# Altium project RPI_FEZ_DAC_00.PrjPcb
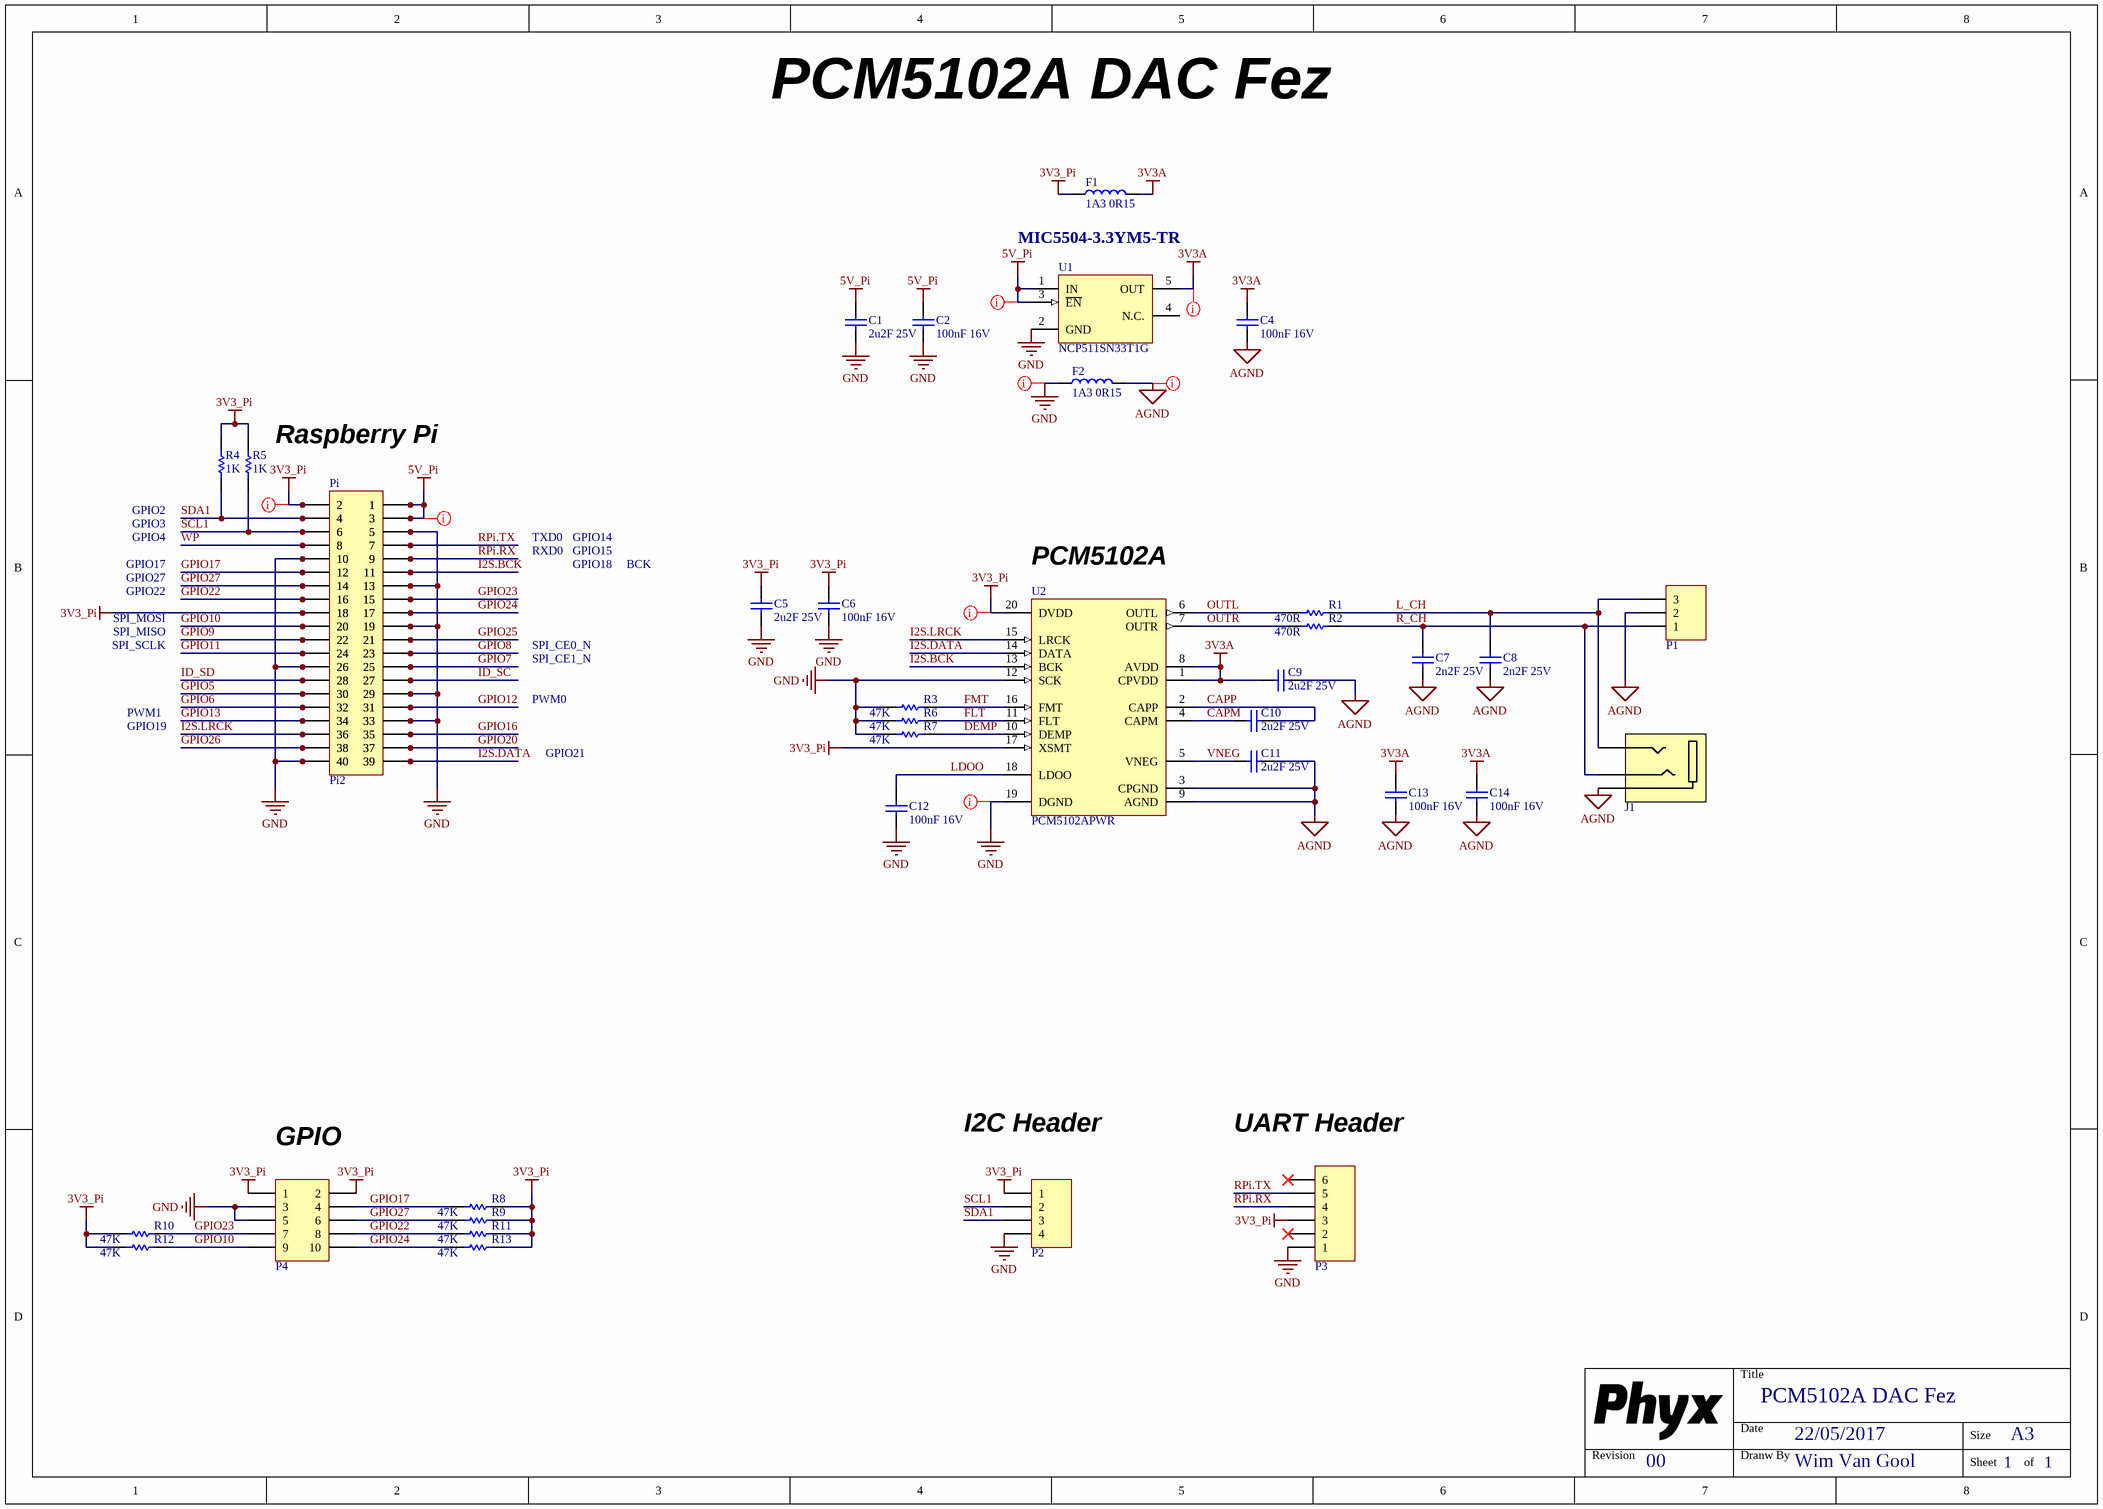
[diagram p0: RPI_FEZ_DAC_00.SchDoc]
PCB_ENGINEER: WimVG; PCB_REV: 00; PCB_TITLE: PCM5102A DAC Fez
1 sheet, 37 parts. Net scope: global (net labels, ports and power ports of the same name join across sheets).
Board file: RPI_FEZ_DAC_00.PcbDoc

## Sheet RPI_FEZ_DAC_00.SchDoc: PCM5102A DAC Fez
size A3; Date: 22/05/2017; DrawnBy: Wim Van Gool; Revision: 00; SheetNumber: 1; SheetTotal: 1

### Parts
C1  value 2u2F 25V  [C1206_N]  (hidden comment: CAP_CERAMIC)
C2  value 100nF 16V  [C0603_N]  (hidden comment: CAP_CERAMIC)
C4  value 100nF 16V  [C0603_N]  (hidden comment: CAP_CERAMIC)
C5  value 2u2F 25V  [C1206_N]  (hidden comment: CAP_CERAMIC)
C6  value 100nF 16V  [C0603_N]  (hidden comment: CAP_CERAMIC)
C7  value 2n2F 25V  [C0603_N]  (hidden comment: CAP_CERAMIC)
C8  value 2n2F 25V  [C0603_N]  (hidden comment: CAP_CERAMIC)
C9  value 2u2F 25V  [C1206_N]  (hidden comment: CAP_CERAMIC)
C10  value 2u2F 25V  [C1206_N]  (hidden comment: CAP_CERAMIC)
C11  value 2u2F 25V  [C1206_N]  (hidden comment: CAP_CERAMIC)
C12  value 100nF 16V  [C0603_N]  (hidden comment: CAP_CERAMIC)
C13  value 100nF 16V  [C0603_N]  (hidden comment: CAP_CERAMIC)
C14  value 100nF 16V  [C0603_N]  (hidden comment: CAP_CERAMIC)
F1  value 1A3 0R15  [L0603]  (hidden comment: BLM18KG601SN1D)
F2  value 1A3 0R15  [L0603]  (hidden comment: BLM18KG601SN1D)
J1  3,5mm Stereo Audio Jack SMD  [PJ-313D]  (value not drawn)
P1  Header 3  [HDR1X3]  (value not drawn)
P2  Header 4  [HDR1X4]  (value not drawn)
P3  Header 6  [HDR1X6]  (value not drawn)
P4  Boxed Header 5X2  [B_HDR2X5]  (value not drawn)
Pi  Receptacle # 2x20 61004021821  [WE_61004021821]  (value not drawn)
Pi2  Receptacle 20X2  [HDR2X20]  (value not drawn)
R1  value 470R  [R0603_N]  (hidden comment: RESISTOR)
R2  value 470R  [R0603_N]  (hidden comment: RESISTOR)
R3  value 47K  [R0603_N]  (hidden comment: RESISTOR)
R4  value 1K  [R0603_N]  (hidden comment: RESISTOR)
R5  value 1K  [R0603_N]  (hidden comment: RESISTOR)
R6  value 47K  [R0603_N]  (hidden comment: RESISTOR)
R7  value 47K  [R0603_N]  (hidden comment: RESISTOR)
R8  value 47K  [R0603_N]  (hidden comment: RESISTOR)
R9  value 47K  [R0603_N]  (hidden comment: RESISTOR)
R10  value 47K  [R0603_N]  (hidden comment: RESISTOR)
R11  value 47K  [R0603_N]  (hidden comment: RESISTOR)
R12  value 47K  [R0603_N]  (hidden comment: RESISTOR)
R13  value 47K  [R0603_N]  (hidden comment: RESISTOR)
U1  value NCP511SN33T1G  [ONS_TSOP5]  (hidden comment: 3V3 150mA LDO)
U2  value PCM5102APWR  [TI_PW_R-PDSO-G20]  (hidden comment: Audio Stereo DAC 32BIT 112dB)

### Nets
3V3_Pi: C5.1 C6.1 F1.1 P2.1 P3.3 P4.1 P4.2 Pi.2 Pi.18 Pi2.2 Pi2.18 R4.1 R5.1 R8.1 R9.1 R10.2 R11.1 R12.2 R13.1 U2.17(XSMT) U2.20(DVDD)
3V3A: C4.1 C9.2 C13.1 C14.1 F1.2 U1.5(OUT) U2.1(CPVDD) U2.8(AVDD)
5V_Pi: C1.1 C2.1 Pi.1 Pi.3 Pi2.1 Pi2.3 U1.1(IN) U1.3(~{EN})
AGND: C4.2 C7.2 C8.2 C9.1 C11.1 C13.2 C14.2 F2.2 J1.1(Sleeve) P1.2 U2.3(CPGND) U2.9(AGND)
GND: C1.2 C2.2 C5.2 C6.2 C12.2 F2.1 P2.4 P3.1 P4.3 P4.5 Pi.5 Pi.10 Pi.13 Pi.19 Pi.26 Pi.29 Pi.33 Pi.40 Pi2.5 Pi2.10 Pi2.13 Pi2.19 Pi2.26 Pi2.29 Pi2.33 Pi2.40 R3.2 R6.2 R7.2 U1.2(GND) U2.12(SCK) U2.19(DGND)
CAPM: C10.2 U2.4(CAPM)
CAPP: C10.1 U2.2(CAPP)
DEMP: R7.1 U2.10(DEMP)
FLT: R6.1 U2.11(FLT)
FMT: R3.1 U2.16(FMT)
GPIO5: Pi.30 Pi2.30
GPIO6: Pi.32 Pi2.32
GPIO7: Pi.25 Pi2.25
GPIO8: Pi.23 Pi2.23
GPIO9: Pi.22 Pi2.22
GPIO10: P4.9 Pi.20 Pi2.20 R12.1
GPIO11: Pi.24 Pi2.24
GPIO12: Pi.31 Pi2.31
GPIO13: Pi.34 Pi2.34
GPIO16: Pi.35 Pi2.35
GPIO17: P4.4 Pi.12 Pi2.12 R8.2
GPIO20: Pi.37 Pi2.37
GPIO22: P4.8 Pi.16 Pi2.16 R11.2
GPIO23: P4.7 Pi.15 Pi2.15 R10.1
GPIO24: P4.10 Pi.17 Pi2.17 R13.2
GPIO25: Pi.21 Pi2.21
GPIO26: Pi.38 Pi2.38
GPIO27: P4.6 Pi.14 Pi2.14 R9.2
I2S.BCK: Pi.11 Pi2.11 U2.13(BCK)
I2S.DATA: Pi.39 Pi2.39 U2.14(DATA)
I2S.LRCK: Pi.36 Pi2.36 U2.15(LRCK)
ID_SC: Pi.27 Pi2.27
ID_SD: Pi.28 Pi2.28
L_CH: C8.1 J1.2(Tip) P1.3 R1.1
LDOO: C12.1 U2.18(LDOO)
OUTL: R1.2 U2.6(OUTL)
OUTR: R2.2 U2.7(OUTR)
R_CH: C7.1 J1.3(Ring) P1.1 R2.1
RPi.RX: P3.4 Pi.9 Pi2.9
RPi.TX: P3.5 Pi.7 Pi2.7
SCL1: P2.2 Pi.6 Pi2.6 R5.2
SDA1: P2.3 Pi.4 Pi2.4 R4.2
VNEG: C11.2 U2.5(VNEG)
WP: Pi.8 Pi2.8

Not connected (* = marked no-connect by the designer): P3 2* 6*; U1 4(N.C.)

### Layout directives
net class POWER: 3V3_Pi, 3V3A, 5V_Pi, AGND, GND

### Notes on the sheet
- PCM5102A DAC Fez
- MIC5504-3.3YM5-TR
- (near R5) Raspberry Pi
- GPIO2
- GPIO17
- GPIO3
- GPIO4
- GPIO27
- TXD0
- RXD0
- GPIO18
- GPIO14
- GPIO15
- BCK
- (near U2) PCM5102A
- SPI_MISO
- GPIO22
- SPI_MOSI
- SPI_SCLK
- SPI_CE0_N
- PWM1
- SPI_CE1_N
- PWM0
- GPIO19
- GPIO21
- (near P4) GPIO
- I2C Header
- (near P3) UART Header
- Title
- Revision
- Date
- Dranw By
- Size
- A3
- Sheet
- of

### Library data of the parts
C1 C5 C9-C11 = CAP # 2u2F 25V 1206: Capacitor Ceramic; Supplier 1: Farnell; Supplier Part Number 1: 1735544
C2 C4 C6 C12-C14 = CAP # 100nF 16V 0603: Capacitor Ceramic
C7 C8 = CAP # 2n2F 25V 0603: Capacitor Ceramic
F1 F2 = FER # 600R 1A3 0603 0R15 BLM18KG601SN1D: Supplier 1: Farnell; Supplier Part Number 1: 1781094
J1 = AUDIO JACK # 3.5 3c PJ-313D: =Description; Value: PJ-313D; Supplier 1: AliExpress; Supplier Part Number 1: PJ-313D
P1 = Pin Header 2.54mm 3way
P2 = Pin Header 2.54mm 4way
P3 = Pin Header 2.54mm 6way
P4 = Pin Header 2.54mm dual row 10way Boxed
Pi = Receptacle # 2x20 61004021821: =Description; Value: 61004021821; Supplier 1: Farnell
Pi2 = Pin Header 2.54mm dual row 40way: =Description
R1 R2 = RES # 470R 0603
R3 R6-R13 = RES # 47K 0603
R4 R5 = RES # 1K 0603
U1 = LDO # 3V3 0A15 NCP511SN33T1G: =Description; Supplier 1: Farnell; Supplier Part Number 1: 1652367
U2 = DAC # AUDIO PCM5102APWR: =Description; Supplier 1: Farnell; Supplier Part Number 1: 2402251

## Assembly variants
Not Mounted: not fitted C10 C11 C12 C13 C14 CON1 CON2 F1 P1 P1 P2 P5 P6 Pi SW1 SW2 SW3